# EAGLE design amebot_sensors (EAGLE 6.5.0)
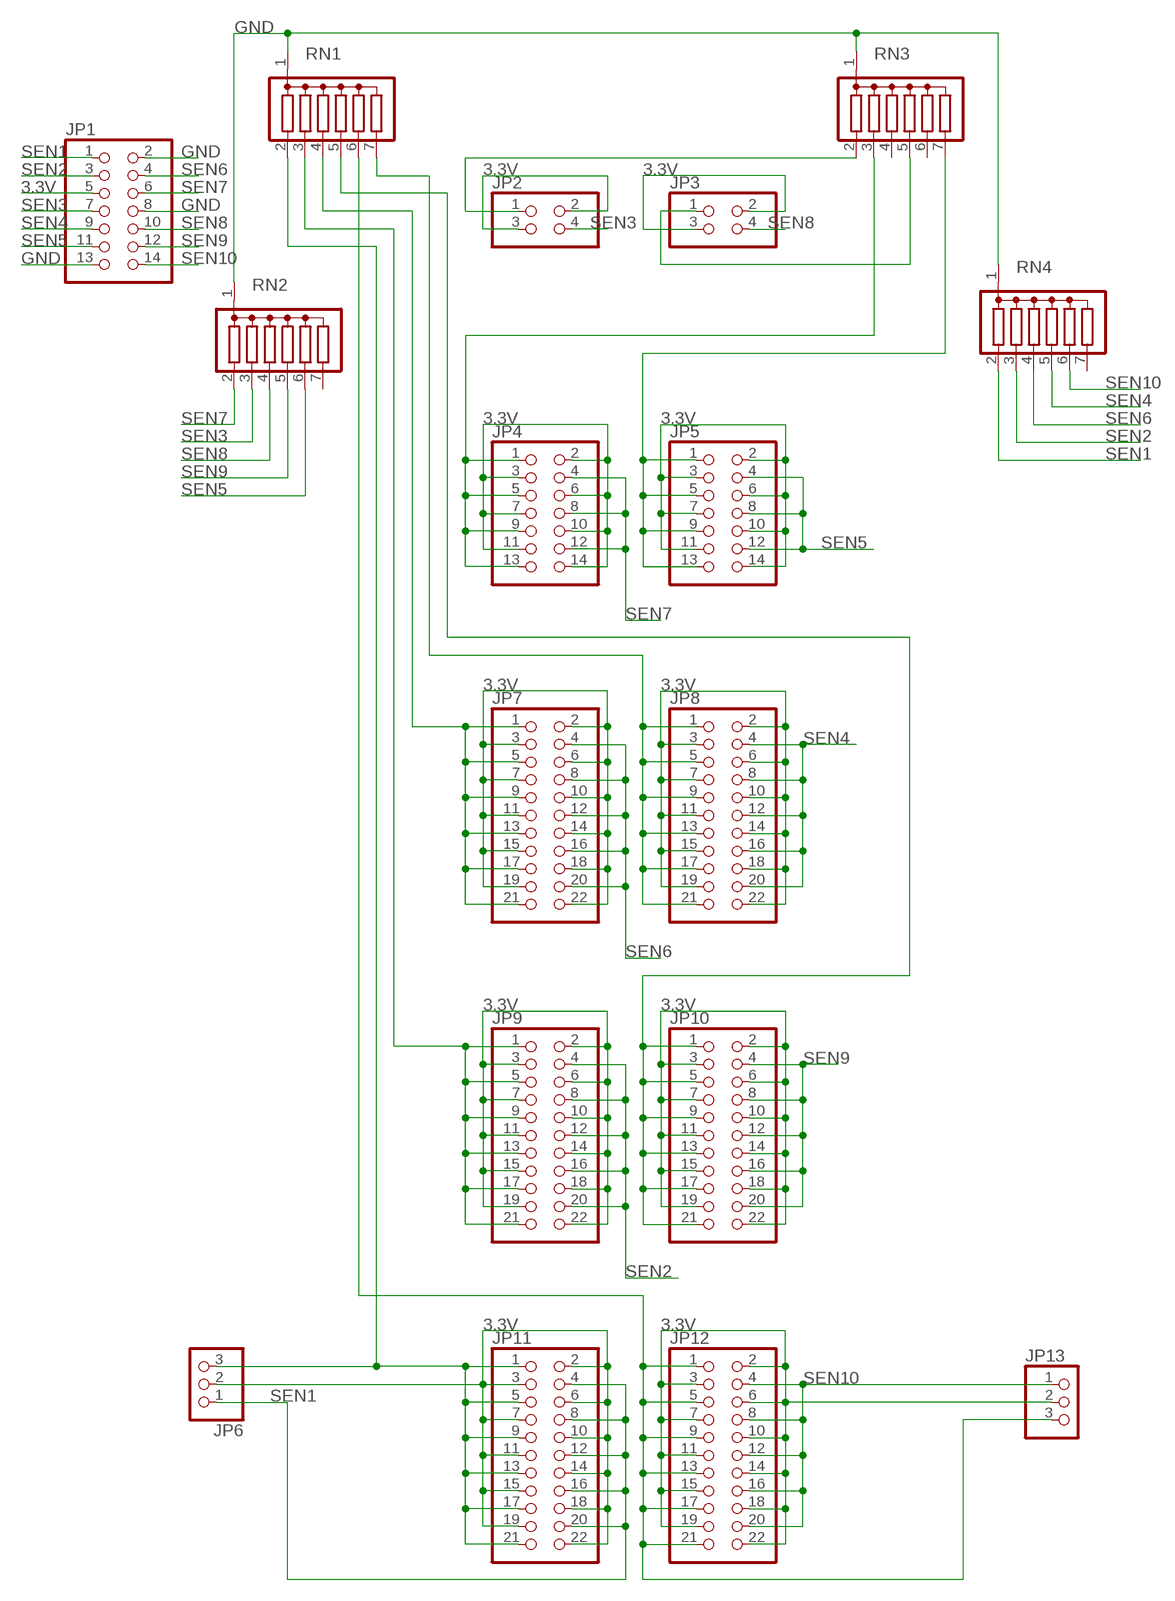
[diagram p0: schematic, sheet 1]

## Parts
JP1  PINHD-2X7  [2X07]
JP2  PINHD-2X2  [2X02]
JP3  PINHD-2X2  [2X02]
JP4  PINHD-2X7  [2X07]
JP5  PINHD-2X7  [2X07]
JP6  PINHD-1X3  [1X03]
JP7  PINHD-2X11  [2X11]
JP8  PINHD-2X11  [2X11]
JP9  PINHD-2X11  [2X11]
JP10  PINHD-2X11  [2X11]
JP11  PINHD-2X11  [2X11]
JP12  PINHD-2X11  [2X11]
JP13  PINHD-1X3  [1X03]
RN1  G06R  [SIL7]
RN2  G06R  [SIL7]
RN3  G06R  [SIL7]
RN4  G06R  [SIL7]

## Nets
3.3V: JP1.5 JP2.2 JP2.3 JP3.2 JP3.3 JP4.2 JP4.3 JP4.6 JP4.7 JP4.10 JP4.11 JP4.14 JP5.2 JP5.3 JP5.6 JP5.7 JP5.10 JP5.11 JP5.14 JP6.2 JP7.2 JP7.3 JP7.6 JP7.7 JP7.10 JP7.11 JP7.14 JP7.15 JP7.18 JP7.19 JP7.22 JP8.2 JP8.3 JP8.6 JP8.7 JP8.10 JP8.11 JP8.14 JP8.15 JP8.18 JP8.19 JP8.22 JP9.2 JP9.3 JP9.6 JP9.7 JP9.10 JP9.11 JP9.14 JP9.15 JP9.18 JP9.19 JP9.22 JP10.2 JP10.3 JP10.6 JP10.7 JP10.10 JP10.11 JP10.14 JP10.15 JP10.18 JP10.19 JP10.22 JP11.2 JP11.3 JP11.6 JP11.7 JP11.10 JP11.11 JP11.14 JP11.15 JP11.18 JP11.19 JP11.22 JP12.2 JP12.3 JP12.6 JP12.7 JP12.10 JP12.11 JP12.14 JP12.15 JP12.18 JP12.19 JP12.22 JP13.2
GND: JP1.2 JP1.8 JP1.13 RN1.1 RN2.1 RN3.1 RN4.1
N$1: JP8.1 JP8.5 JP8.9 JP8.13 JP8.17 JP8.21 RN1.7
N$2: JP2.1 RN3.2
N$3: JP7.1 JP7.5 JP7.9 JP7.13 JP7.17 JP7.21 RN1.4
N$4: JP4.1 JP4.5 JP4.9 JP4.13 RN3.3
N$5: JP5.1 JP5.5 JP5.9 JP5.13 RN3.7
N$6: JP3.1 RN3.5
N$8: JP12.1 JP12.5 JP12.9 JP12.13 JP12.17 JP12.21 JP13.3 RN1.6
N$9: JP6.3 JP11.1 JP11.5 JP11.9 JP11.13 JP11.17 JP11.21 RN1.2
N$10: JP9.1 JP9.5 JP9.9 JP9.13 JP9.17 JP9.21 RN1.3
N$20: JP10.1 JP10.5 JP10.9 JP10.13 JP10.17 JP10.21 RN1.5
SEN1: JP1.1 JP6.1 JP11.4 JP11.8 JP11.12 JP11.16 JP11.20 RN4.2
SEN2: JP1.3 JP9.4 JP9.8 JP9.12 JP9.16 JP9.20 RN4.3
SEN3: JP1.7 JP2.4 RN2.3
SEN4: JP1.9 JP8.4 JP8.8 JP8.12 JP8.16 JP8.20 RN4.5
SEN5: JP1.11 JP5.4 JP5.8 JP5.12 RN2.6
SEN6: JP1.4 JP7.4 JP7.8 JP7.12 JP7.16 JP7.20 RN4.4
SEN7: JP1.6 JP4.4 JP4.8 JP4.12 RN2.2
SEN8: JP1.10 JP3.4 RN2.4
SEN9: JP1.12 JP10.4 JP10.8 JP10.12 JP10.16 JP10.20 RN2.5
SEN10: JP1.14 JP12.4 JP12.8 JP12.12 JP12.16 JP12.20 JP13.1 RN4.6
Unconnected: RN2.7 RN3.4 RN3.6 RN4.7

## Library data of the parts
JP1 JP4 JP5 = pinhead:PINHD-2X7: PIN HEADER
JP2 JP3 = pinhead:PINHD-2X2: PIN HEADER
JP6 JP13 = pinhead:PINHD-1X3: PIN HEADER
JP7-JP12 = pinhead:PINHD-2X11: PIN HEADER
RN1-RN4 = resistor-sil:G06R: SIL RESISTOR; OC_FARNELL: unknown; OC_NEWARK: unknown

## Board
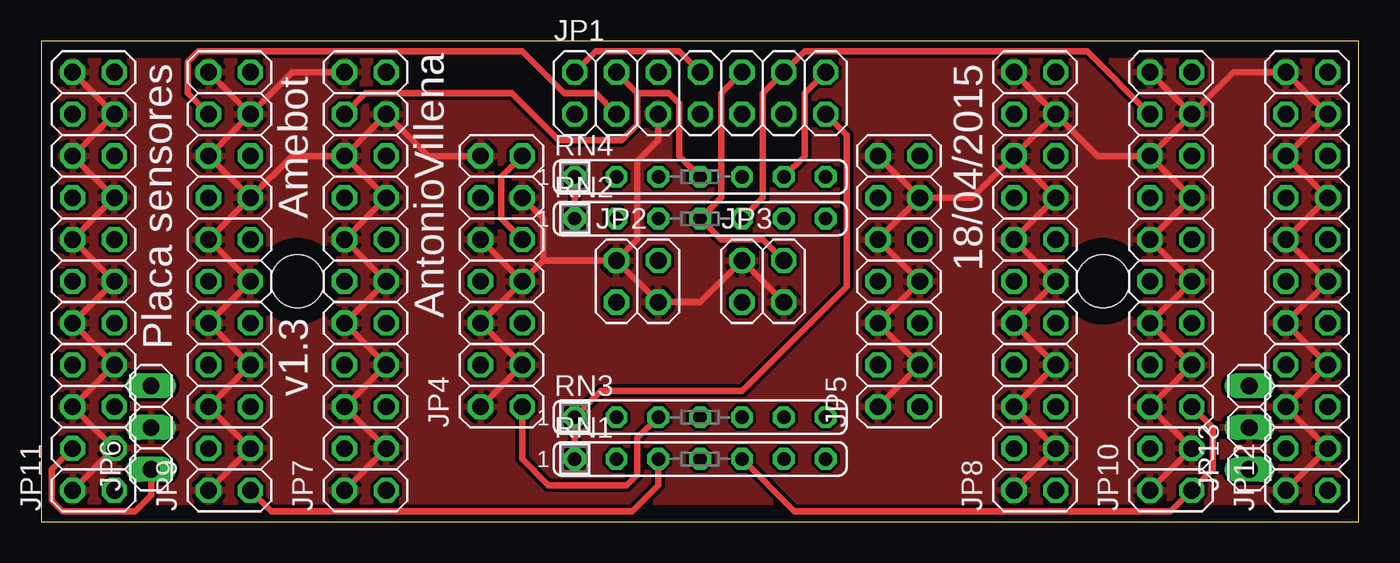
[diagram p1: board, top side]
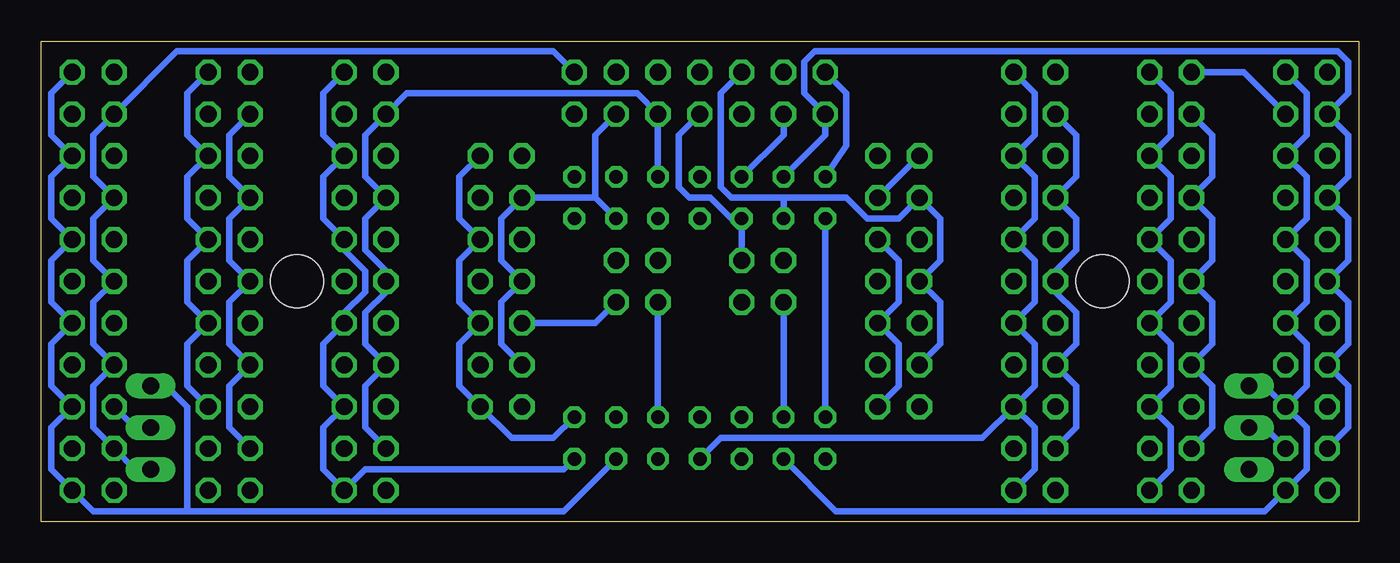
[diagram p2: board, bottom side, seen from below]

Size 79.99 x 29.2 mm. Coordinates in mm from the lower left corner, seen from the top.
Outline: 0,0 79.99,0 79.99,29.2 0,29.2 0,0
Copper layers (1*16): Top 0.035mm / dielectric 1.5mm / Bottom 0.035mm
Design rules "default": minimum track width 10mil, minimum drill 24mil, track to track 8mil, track to pad 8mil, pad to pad 8mil, via to via 8mil, smd to smd 8mil, copper to edge 40mil, drill to drill 8mil, minimum pad ring 10mil, minimum via ring 8mil, stop-mask expansion 4mil, vias tented up to drill 0mil, thermal gap 10mil
Holes 3.2 mm at 15.56,14.61 64.45,14.61

### Footprints (pad centres in the part's own frame; a part is rotated, then mirrored left to right if it is on the bottom)
2X07 = drill 1.016 octagon: 1 -7.62,-1.27; 2 -7.62,1.27; 3 -5.08,-1.27; 4 -5.08,1.27; 5 -2.54,-1.27; 6 -2.54,1.27; 7 0,-1.27; 8 0,1.27; 9 2.54,-1.27; 10 2.54,1.27; 11 5.08,-1.27; 12 5.08,1.27; 13 7.62,-1.27; 14 7.62,1.27
2X02 = drill 1.016 octagon: 1 -1.27,-1.27; 2 -1.27,1.27; 3 1.27,-1.27; 4 1.27,1.27
1X03 = drill 1.016 long: 1 -2.54,0; 2 0,0; 3 2.54,0
2X11 = drill 1.016 octagon: 1 -12.7,-1.27; 2 -12.7,1.27; 3 -10.16,-1.27; 4 -10.16,1.27; 5 -7.62,-1.27; 6 -7.62,1.27; 7 -5.08,-1.27; 8 -5.08,1.27; 9 -2.54,-1.27; 10 -2.54,1.27; 11 0,-1.27; 12 0,1.27; 13 2.54,-1.27; 14 2.54,1.27; 15 5.08,-1.27; 16 5.08,1.27; 17 7.62,-1.27; 18 7.62,1.27; 19 10.16,-1.27; 20 10.16,1.27; 21 12.7,-1.27; 22 12.7,1.27
SIL7 = drill 0.813 octagon: 1 -7.62,0; 2 -5.08,0; 3 -2.54,0; 4 0,0; 5 2.54,0; 6 5.08,0; 7 7.62,0

### Placement (x,y rotation side)
JP1  40.01,26.04 0 top
JP2  36.2,14.61 0 top
JP3  43.81,14.61 0 top
JP4  27.94,14.61 90 top
JP5  52.07,14.61 90 top
JP6  6.67,5.71 90 top
JP7  19.68,14.61 90 top
JP8  60.33,14.61 90 top
JP9  11.43,14.61 90 top
JP10  68.58,14.61 90 top
JP11  3.17,14.61 90 top
JP12  76.83,14.61 90 top
JP13  73.34,5.71 90 top
RN1  40.01,3.81 0 top
RN2  40.01,18.41 0 top
RN3  40.01,6.35 0 top
RN4  40.01,20.95 0 top

### Tracks (layer width: path | path; a pad name or v marks a point on that pad's centre or on a via)
3.3V
  Top 0.406: JP2.2 JP2.3 40.01,13.34 JP3.2 JP3.3 | JP4.2 JP4.3 JP4.6 JP4.7 | JP4.7 JP4.10 | JP4.11 30.48,18.41 30.48,15.88 | JP5.14 JP5.11 | JP5.11 JP5.10 JP5.7 JP5.6 JP5.3 JP5.2 | JP8.22 JP8.19 | JP8.19 JP8.18 | JP8.18 56.52,19.68 JP5.11 | JP8.18 JP8.15 JP8.14 JP8.11 JP8.10 JP8.7 JP8.6 JP8.3 JP8.2 | JP7.18 JP7.19 23.5,22.23 JP4.14 | JP7.18 JP7.15 JP7.14 JP7.11 JP7.10 JP7.7 JP7.6 JP7.3 JP7.2 | JP10.22 JP10.19 | JP10.19 JP10.18 | JP10.18 JP10.15 JP10.14 JP10.11 JP10.10 JP10.7 JP10.6 JP10.3 JP10.2 | JP10.18 64.14,22.23 JP8.19 | JP9.22 JP9.19 | JP9.19 JP9.18 JP9.15 | JP9.15 JP9.14 JP9.11 JP9.10 JP9.7 JP9.6 JP9.3 JP9.2 | JP9.19 15.24,27.3 JP7.22 | JP9.15 15.24,22.23 JP7.18 | JP12.2 JP12.3 JP12.6 JP12.7 JP12.10 JP12.11 JP12.14 JP12.15 JP12.18 JP12.19 JP12.22 72.39,27.3 JP10.19 | JP11.22 JP11.19 JP11.18 JP11.15 JP11.14 JP11.11 JP11.10 JP11.7 JP11.6 JP11.3 JP11.2 | JP1.5 37.47,23.18 36.2,21.91 36.2,17.14 JP2.2 | JP2.2 30.48,15.88 | 30.48,15.88 JP4.7
  Bottom 0.406: JP4.14 JP4.11 | JP13.2 74.3,5.71 JP12.6 | JP11.19 6.99,27.3 JP9.22 | JP6.2 5.71,5.71 JP11.3 | JP5.6 46.35,12.06 JP3.3
  pour Top: 0.32,28.89 79.69,28.89 79.69,0.32 0.32,0.32
GND
  Top 0.406: JP1.2 33.66,28.57 38.73,28.57 JP1.8 | RN4.1 RN2.1 | JP1.13 48.9,23.5 48.9,14.29 42.55,7.94 33.97,7.94 RN3.1 RN1.1
  Bottom 0.406: JP1.2 31.11,26.04 31.11,22.86 RN4.1 | RN2.1 RN3.1
N$1
  Bottom 0.406: JP8.21 62.87,26.04 62.87,23.5 JP8.17 62.87,20.95 62.87,18.41 JP8.13 61.59,16.51 60.33,15.24 60.33,13.97 61.59,12.7 JP8.9 62.87,10.79 62.87,8.26 JP8.5 62.87,5.71 62.87,3.17 JP8.1 60.33,3.17 48.26,3.17 RN1.7
N$2
  Bottom 0.406: JP2.1 RN3.2
N$3
  Bottom 0.406: JP7.21 19.68,26.04 19.68,23.5 JP7.17 19.68,20.95 19.68,18.41 JP7.13 19.68,15.88 19.68,13.34 JP7.9 19.68,10.79 19.68,8.26 JP7.5 | JP7.5 19.68,5.71 19.68,3.17 JP7.1 | RN1.4 38.73,5.08 22.86,5.08 JP7.5
N$4
  Top 0.406: JP4.13 27.94,20.95 27.94,18.41 JP4.9 | RN3.3 36.2,5.08 36.2,2.86 35.56,2.22 30.8,2.22 29.21,3.81 JP4.1
  Bottom 0.406: JP4.9 27.94,15.88 27.94,13.34 JP4.5 27.94,10.79 27.94,8.26 JP4.1
N$5
  Bottom 0.406: JP5.13 54.61,20.95 54.61,18.41 JP5.9 54.61,15.88 54.61,13.34 JP5.5 54.61,10.79 54.61,8.26 JP5.1 51.44,5.08 48.9,5.08 RN3.7
N$6
  Bottom 0.406: JP3.1 RN3.5
N$8
  Bottom 0.406: JP12.21 79.38,26.04 79.38,23.5 JP12.17 79.38,20.95 79.38,18.41 JP12.13 79.38,15.88 79.38,13.34 JP12.9 79.38,10.79 79.38,8.26 JP12.5 79.38,5.71 79.38,3.17 JP12.1 76.83,0.64 71.12,0.64 | 71.12,0.64 48.26,0.64 RN1.6 | JP13.3 72.39,8.26 71.12,6.99 71.12,0.64
N$9
  Bottom 0.406: JP11.21 3.17,26.04 3.17,23.5 JP11.17 3.17,20.95 3.17,18.41 JP11.13 3.17,15.88 3.17,13.34 JP11.9 3.17,10.79 3.17,8.26 JP11.5 | JP11.5 3.17,5.71 3.17,3.17 JP11.1 5.71,0.64 31.75,0.64 RN1.2 | JP6.3 5.71,8.26 JP11.5
N$10
  Top 0.406: JP9.1 13.97,0.64 35.88,0.64 37.47,2.22 RN1.3
  Bottom 0.406: JP9.21 11.43,26.04 11.43,23.5 JP9.17 11.43,20.95 11.43,18.41 JP9.13 11.43,15.88 11.43,13.34 JP9.9 11.43,10.79 11.43,8.26 JP9.5 11.43,5.71 11.43,3.17 JP9.1
N$20
  Top 0.406: RN1.5 45.72,0.64 68.58,0.64 JP10.1 71.12,3.17 71.12,5.71 JP10.5
  Bottom 0.406: JP10.21 71.12,26.04 71.12,23.5 JP10.17 71.12,20.95 71.12,18.41 JP10.13 71.12,15.88 71.12,13.34 JP10.9 71.12,10.79 71.12,8.26 JP10.5
SEN1
  Top 0.406: JP6.1 6.67,1.59 5.71,0.64 1.27,0.64 0.64,1.27 0.64,3.17 JP11.4
  Bottom 0.406: JP11.4 0.64,5.71 0.64,8.26 JP11.8 0.64,10.79 0.64,13.34 JP11.12 0.64,15.88 0.64,18.41 JP11.16 0.64,20.95 0.64,23.5 JP11.20 0.64,26.04 0.64,27.94 1.27,28.57 33.02,28.57 33.66,27.94 33.66,26.04 JP1.1 32.38,23.5 RN4.2
SEN2
  Top 0.406: JP9.20 8.89,26.04 8.89,27.94 9.53,28.57 29.21,28.57 31.75,26.04 33.66,26.04 JP1.3
  Bottom 0.406: JP9.20 8.89,23.5 8.89,20.95 JP9.16 8.89,18.41 8.89,15.88 JP9.12 8.89,13.34 8.89,10.79 JP9.8 8.89,8.26 8.89,5.71 JP9.4 | JP1.3 34.92,23.5 RN4.3
SEN3
  Bottom 0.406: JP1.7 41.27,23.5 41.27,20.32 40.64,19.68 39.37,19.68 38.1,18.41 RN2.3 JP2.4
SEN4
  Bottom 0.406: JP8.4 60.33,5.71 60.33,8.26 JP8.8 60.33,10.79 60.33,12.7 59.05,13.97 JP8.12 59.05,15.24 60.33,16.51 60.33,18.41 JP8.16 60.33,20.95 60.33,23.5 JP8.20 57.78,26.04 43.81,26.04 JP1.9 RN4.5
SEN5
  Bottom 0.406: JP5.4 52.07,10.79 52.07,13.34 JP5.8 52.07,15.88 52.07,18.41 JP5.12 46.35,19.68 | JP1.11 46.35,23.5 46.35,19.68 | 46.35,19.68 RN2.6
SEN6
  Top 0.406: JP7.20 19.68,26.04 28.57,26.04 31.43,23.18 35.24,23.18 36.2,24.13 36.2,26.04 | 36.2,26.04 JP1.4 | RN4.4 38.73,22.23 38.73,25.4 38.1,26.04 36.2,26.04
  Bottom 0.406: JP7.20 17.14,23.5 17.14,20.95 JP7.16 17.14,18.41 17.14,16.51 18.41,15.24 JP7.12 18.41,13.97 17.14,12.7 17.14,10.79 JP7.8 17.14,8.26 17.14,5.71 JP7.4
SEN7
  Bottom 0.406: JP4.4 25.4,10.79 25.4,13.34 JP4.8 25.4,15.88 25.4,18.41 JP4.12 27.94,18.41 29.84,18.41 31.11,19.68 34.92,19.68 | 34.92,19.68 38.1,19.68 38.73,20.32 38.73,26.04 JP1.6 | RN2.2 34.92,19.68
SEN8
  Top 0.406: JP1.10 41.27,26.04 41.27,19.68 RN2.4 41.27,17.14 43.81,17.14 JP3.4
SEN9
  Top 0.406: JP10.20 63.5,28.57 46.35,28.57 JP1.12 43.81,26.04 43.81,19.68 RN2.5
  Bottom 0.406: JP10.20 68.58,23.5 68.58,20.95 JP10.16 68.58,18.41 68.58,15.88 JP10.12 68.58,13.34 68.58,10.79 JP10.8 68.58,8.26 68.58,5.71 JP10.4
SEN10
  Top 0.406: JP1.14 46.35,26.04 46.35,22.23 RN4.6
  Bottom 0.406: JP1.14 48.9,28.57 71.75,28.57 JP12.20 76.83,23.5 76.83,20.95 JP12.16 76.83,18.41 76.83,15.88 JP12.12 76.83,13.34 76.83,10.79 JP12.8 76.83,8.26 76.83,5.71 JP12.4 74.3,3.17 JP13.1

### Text on the board
tPlace: Amebot | 18/04/2015 | AntonioVillena | Placa sensores | v1.3